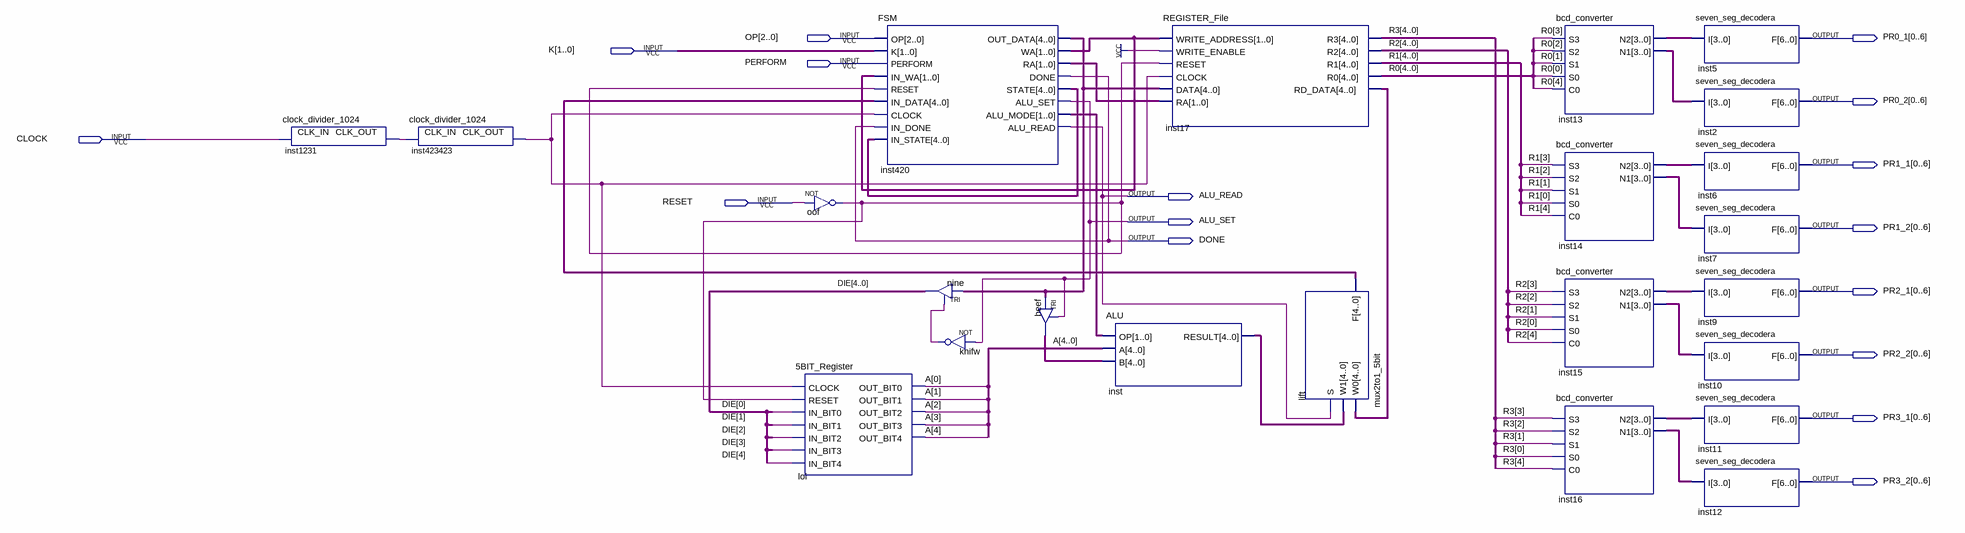
[diagram p0: schematic sheet]
// Quartus schematic FSM_COMPLETE.bdf as structural Verilog: 23 symbols, 16 pins
module FSM_COMPLETE (
  input  [2:0] OP,
  input  [1:0] K,
  input  PERFORM,
  input  CLOCK,
  input  RESET,
  output [0:6] PR0_1,
  output [0:6] PR0_2,
  output [0:6] PR1_1,
  output ALU_READ,
  output ALU_SET,
  output [0:6] PR1_2,
  output DONE,
  output [0:6] PR2_1,
  output [0:6] PR2_2,
  output [0:6] PR3_1,
  output [0:6] PR3_2
);

  wire inst1231_clk_out, inst423423_clk_out, knifw_out, oof_out;
  wire [1:0] inst420_alu_mode, inst420_ra, inst420_wa;
  wire [3:0] inst13_n1, inst13_n2, inst14_n1, inst14_n2, inst15_n1, inst15_n2, inst16_n1, inst16_n2;
  wire [4:0] A, beef_out, DIE, inst17_rd_data, inst420_out_data, inst420_state, inst_result, lift_f, R0, R1,
       R2, R3;

  clock_divider_1024 inst1231 (.CLK_IN(CLOCK), .CLK_OUT(inst1231_clk_out));
  clock_divider_1024 inst423423 (.CLK_IN(inst1231_clk_out), .CLK_OUT(inst423423_clk_out));
  not oof (oof_out, RESET);
  \5BIT_Register  lol (
    .CLOCK(inst423423_clk_out), .RESET(oof_out), .IN_BIT0(DIE[0]), .IN_BIT1(DIE[1]), .IN_BIT2(DIE[2]),
    .IN_BIT3(DIE[3]), .IN_BIT4(DIE[4]), .OUT_BIT0(A[0]), .OUT_BIT1(A[1]), .OUT_BIT2(A[2]), .OUT_BIT3(A[3]),
    .OUT_BIT4(A[4]));
  FSM inst420 (
    .OP(OP), .K(K), .PERFORM(PERFORM), .IN_WA(inst420_wa), .RESET(oof_out), .IN_DATA(lift_f),
    .CLOCK(inst423423_clk_out), .IN_DONE(DONE), .IN_STATE(inst420_state), .OUT_DATA(inst420_out_data),
    .WA(inst420_wa), .RA(inst420_ra), .DONE(DONE), .STATE(inst420_state), .ALU_SET(ALU_SET),
    .ALU_MODE(inst420_alu_mode), .ALU_READ(ALU_READ));
  TRI nine[4:0] (.IN(inst420_out_data), .OE(knifw_out), .OUT(DIE));
  not knifw (knifw_out, ALU_SET);
  TRI beef[4:0] (.IN(inst420_out_data), .OE(ALU_SET), .OUT(beef_out));
  ALU inst (.OP(inst420_alu_mode), .A(A), .B(beef_out), .RESULT(inst_result));
  REGISTER_File inst17 (
    .WRITE_ADDRESS(inst420_wa), .WRITE_ENABLE(1'b1), .RESET(oof_out), .CLOCK(inst423423_clk_out),
    .DATA(inst420_out_data), .RA(inst420_ra), .R3(R3), .R2(R2), .R1(R1), .R0(R0), .RD_DATA(inst17_rd_data));
  mux2to1_5bit lift (.W0(inst17_rd_data), .W1(inst_result), .S(ALU_READ), .F(lift_f));
  bcd_converter inst13 (.S3(R0[3]), .S2(R0[2]), .S1(R0[1]), .S0(R0[0]), .C0(R0[4]), .N2(inst13_n2), .N1(inst13_n1));
  bcd_converter inst14 (.S3(R1[3]), .S2(R1[2]), .S1(R1[1]), .S0(R1[0]), .C0(R1[4]), .N2(inst14_n2), .N1(inst14_n1));
  bcd_converter inst15 (.S3(R2[3]), .S2(R2[2]), .S1(R2[1]), .S0(R2[0]), .C0(R2[4]), .N2(inst15_n2), .N1(inst15_n1));
  bcd_converter inst16 (.S3(R3[3]), .S2(R3[2]), .S1(R3[1]), .S0(R3[0]), .C0(R3[4]), .N2(inst16_n2), .N1(inst16_n1));
  seven_seg_decodera inst5 (.I(inst13_n2), .F(PR0_1));
  seven_seg_decodera inst2 (.I(inst13_n1), .F(PR0_2));
  seven_seg_decodera inst6 (.I(inst14_n2), .F(PR1_1));
  seven_seg_decodera inst7 (.I(inst14_n1), .F(PR1_2));
  seven_seg_decodera inst9 (.I(inst15_n2), .F(PR2_1));
  seven_seg_decodera inst10 (.I(inst15_n1), .F(PR2_2));
  seven_seg_decodera inst11 (.I(inst16_n2), .F(PR3_1));
  seven_seg_decodera inst12 (.I(inst16_n1), .F(PR3_2));
endmodule
